# EAGLE design etch-a-sketch (EAGLE 9.6.2)
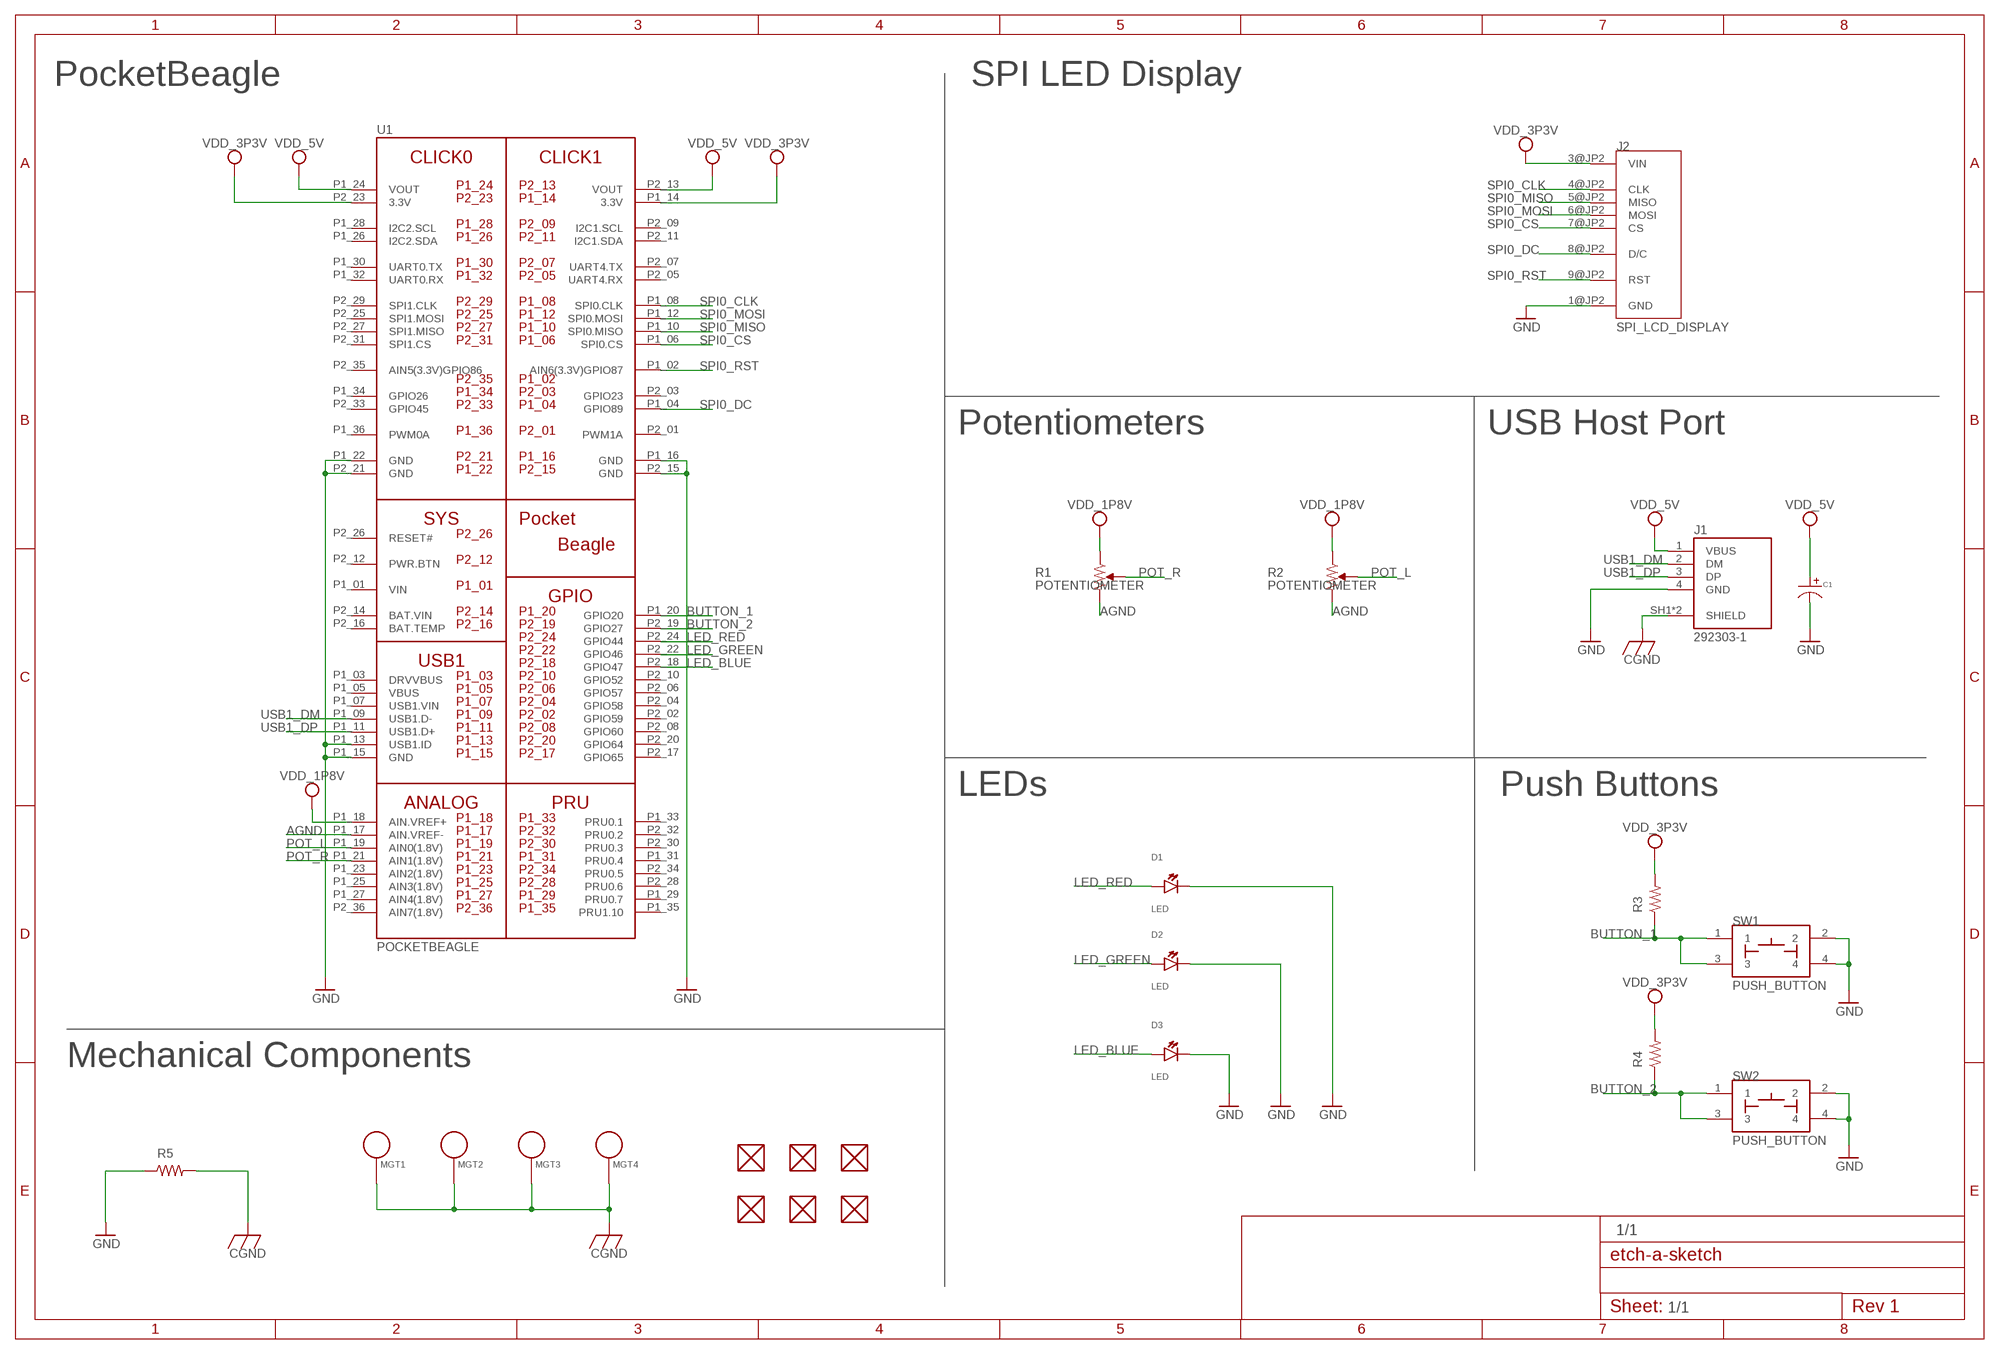
[diagram p0: schematic, sheet 1]

## Parts
C1  CAPACITOR_P_10MM  [CP10MM]
D1  LED  [EIA-STD]
D2  LED  [EIA-STD]
D3  LED  [EIA-STD]
FUD1  FIDUCIAL  [FIDUCIAL_40MIL]
FUD2  FIDUCIAL  [FIDUCIAL_40MIL]
FUD3  FIDUCIAL  [FIDUCIAL_40MIL]
FUD4  FIDUCIAL  [FIDUCIAL_40MIL]
FUD5  FIDUCIAL  [FIDUCIAL_40MIL]
FUD6  FIDUCIAL  [FIDUCIAL_40MIL]
J1  292303-1  [TE_292303-1]
J2  SPI_LCD_DISPLAY  [TFT_LCD_PCB]
MGT1  MOUNTING_HOLE  [MOUNTING_HOLE]
MGT2  MOUNTING_HOLE  [MOUNTING_HOLE]
MGT3  MOUNTING_HOLE  [MOUNTING_HOLE]
MGT4  MOUNTING_HOLE  [MOUNTING_HOLE]
R1  POTENTIOMETER  [POT-PO90S]
R2  POTENTIOMETER  [POT-PO90S]
R3  R_R0603  [R0603]
R4  R_R0603  [R0603]
R5  R_R0603  [R0603]
SW1  PUSH_BUTTON  [BUTTON_12.5MM]
SW2  PUSH_BUTTON  [BUTTON_12.5MM]
U1  POCKETBEAGLE  [POCKETBEAGLE]

## Nets
AGND: R1.CW R2.CW U1.P1_17(AIN.VREF-)
BUTTON_1: R3.1 SW1.1 SW1.3 U1.P1_20(GPIO20)
BUTTON_2: R4.1 SW2.1 SW2.3 U1.P2_19(GPIO27)
CGND: J1.SH1(SHIELD) J1.SH2(SHIELD) MGT1.P$1 MGT2.P$1 MGT3.P$1 MGT4.P$1 R5.2
GND: C1.P$2 D1.CATHODE D2.CATHODE D3.CATHODE J1.4(GND) J2.1@JP2(GND) R5.1 SW1.2 SW1.4 SW2.2 SW2.4 U1.P1_13(USB1.ID) U1.P1_15(GND) U1.P1_16(GND) U1.P1_22(GND) U1.P2_15(GND) U1.P2_21(GND)
LED_BLUE: D3.ANODE U1.P2_18(GPIO47)
LED_GREEN: D2.ANODE U1.P2_22(GPIO46)
LED_RED: D1.ANODE U1.P2_24(GPIO44)
POT_L: R2.S U1.P1_19(AIN0(1.8V))
POT_R: R1.S U1.P1_21(AIN1(1.8V))
SPI0_CLK: J2.4@JP2(CLK) U1.P1_08(SPI0.CLK)
SPI0_CS: J2.7@JP2(CS) U1.P1_06(SPI0.CS)
SPI0_DC: J2.8@JP2(D/C) U1.P1_04(GPIO89)
SPI0_MISO: J2.5@JP2(MISO) U1.P1_10(SPI0.MISO)
SPI0_MOSI: J2.6@JP2(MOSI) U1.P1_12(SPI0.MOSI)
SPI0_RST: J2.9@JP2(RST) U1.P1_02(AIN6(3.3V)GPIO87)
USB1_DM: J1.2(DM) U1.P1_09(USB1.D-)
USB1_DP: J1.3(DP) U1.P1_11(USB1.D+)
VDD_1P8V: R1.CCW R2.CCW U1.P1_18(AIN.VREF+)
VDD_3P3V: J2.3@JP2(VIN) R3.2 R4.2 U1.P1_14(3.3V) U1.P2_23(3.3V)
VDD_5V: C1.P$1 J1.1(VBUS) U1.P1_24(VOUT) U1.P2_13(VOUT)
Unconnected: FUD1.P$1 FUD2.P$1 FUD3.P$1 FUD4.P$1 FUD5.P$1 FUD6.P$1 U1.P1_03(DRVVBUS) U1.P1_05(VBUS) U1.P1_07(USB1.VIN) U1.P1_23(AIN2(1.8V)) U1.P1_25(AIN3(1.8V)) U1.P1_26(I2C2.SDA) U1.P1_27(AIN4(1.8V)) U1.P1_28(I2C2.SCL) U1.P1_29(PRU0.7) U1.P1_30(UART0.TX) U1.P1_31(PRU0.4) U1.P1_32(UART0.RX) U1.P1_33(PRU0.1) U1.P1_34(GPIO26) U1.P1_35(PRU1.10) U1.P1_36(PWM0A) U1.P2_01(PWM1A) U1.P2_02(GPIO59) U1.P2_03(GPIO23) U1.P2_04(GPIO58) U1.P2_05(UART4.RX) U1.P2_06(GPIO57) U1.P2_07(UART4.TX) U1.P2_08(GPIO60) U1.P2_09(I2C1.SCL) U1.P2_10(GPIO52) U1.P2_11(I2C1.SDA) U1.P2_12(PWR.BTN) U1.P2_16(BAT.TEMP) U1.P2_17(GPIO65) U1.P2_20(GPIO64) U1.P2_25(SPI1.MOSI) U1.P2_26(RESET#) U1.P2_27(SPI1.MISO) U1.P2_28(PRU0.6) U1.P2_29(SPI1.CLK) U1.P2_30(PRU0.3) U1.P2_31(SPI1.CS) U1.P2_32(PRU0.2) U1.P2_33(GPIO45) U1.P2_34(PRU0.5) U1.P2_35(AIN5(3.3V)GPIO86) U1.P2_36(AIN7(1.8V))

## Notes on the sheet
- PocketBeagle | SPI LED Display
- Potentiometers | USB Host Port
- LEDs | Push Buttons
- Mechanical Components
- 1/1
- 1/1

## Power pins joined to a net without a drawn wire
BAT.VIN: U1.P2_14(BAT.VIN)
VIN: U1.P1_01(VIN)

## Library data of the parts
C1 = etchpre:CAPACITOR_P: Library: MF_Passives Description: Device for Polarized Capacitors. Manufacture part number (MPN), Voltage Rating, and Tolerance can be added via Attributes. Check https://factory.macrofab.com/parts for the house parts list.; POPULATE: 1
D1-D3 = etchpre:LED: EIA-STD LED, LTST-C191TBKT
FUD1-FUD6 = etchpre:FIDUCIAL
J1 = etchpre:292303-1: CONN USB RECEPT R/A TYPE A 4POS Check availability <https://pricing.snapeda.com/parts/292303-1/TE%20Connectivity/view-part?ref=eda>; AVAILABILITY: In Stock; CENTERLINE_PITCH: 2 mm[.078 in]; COMMENT: 292303-1; DESCRIPTION: Conn; Data; USB; Recept; 2.0; 4 Pos; 1 Port; Rt Angle; A Ser; Tin over Copper; EU_ROHS_COMPLIANCE: Compliant; MF: TE Connectivity; MP: 292303-1; NUMBER_OF_POSITIONS: 4; PACKAGE: None; PRICE: None; PRODUCT_TYPE: Connector; PURCHASE-URL: https://pricing.snapeda.com/search/part/292303-1/?ref=eda
J2 = etchpre:SPI_LCD_DISPLAY
MGT1-MGT4 = etchpre:MOUNTING_HOLE: Chassis Mounting Hole w/GND connection ability
R1 R2 = etchpre:POTENTIOMETER: Potentiometer - Examples: P090S-14T20BR10K (987-1277-ND)
R3-R5 = etchpre:R_: RESISTOR, American symbol
SW1 SW2 = etchpre:PUSH_BUTTON
U1 = etchpre:POCKETBEAGLE

## Board
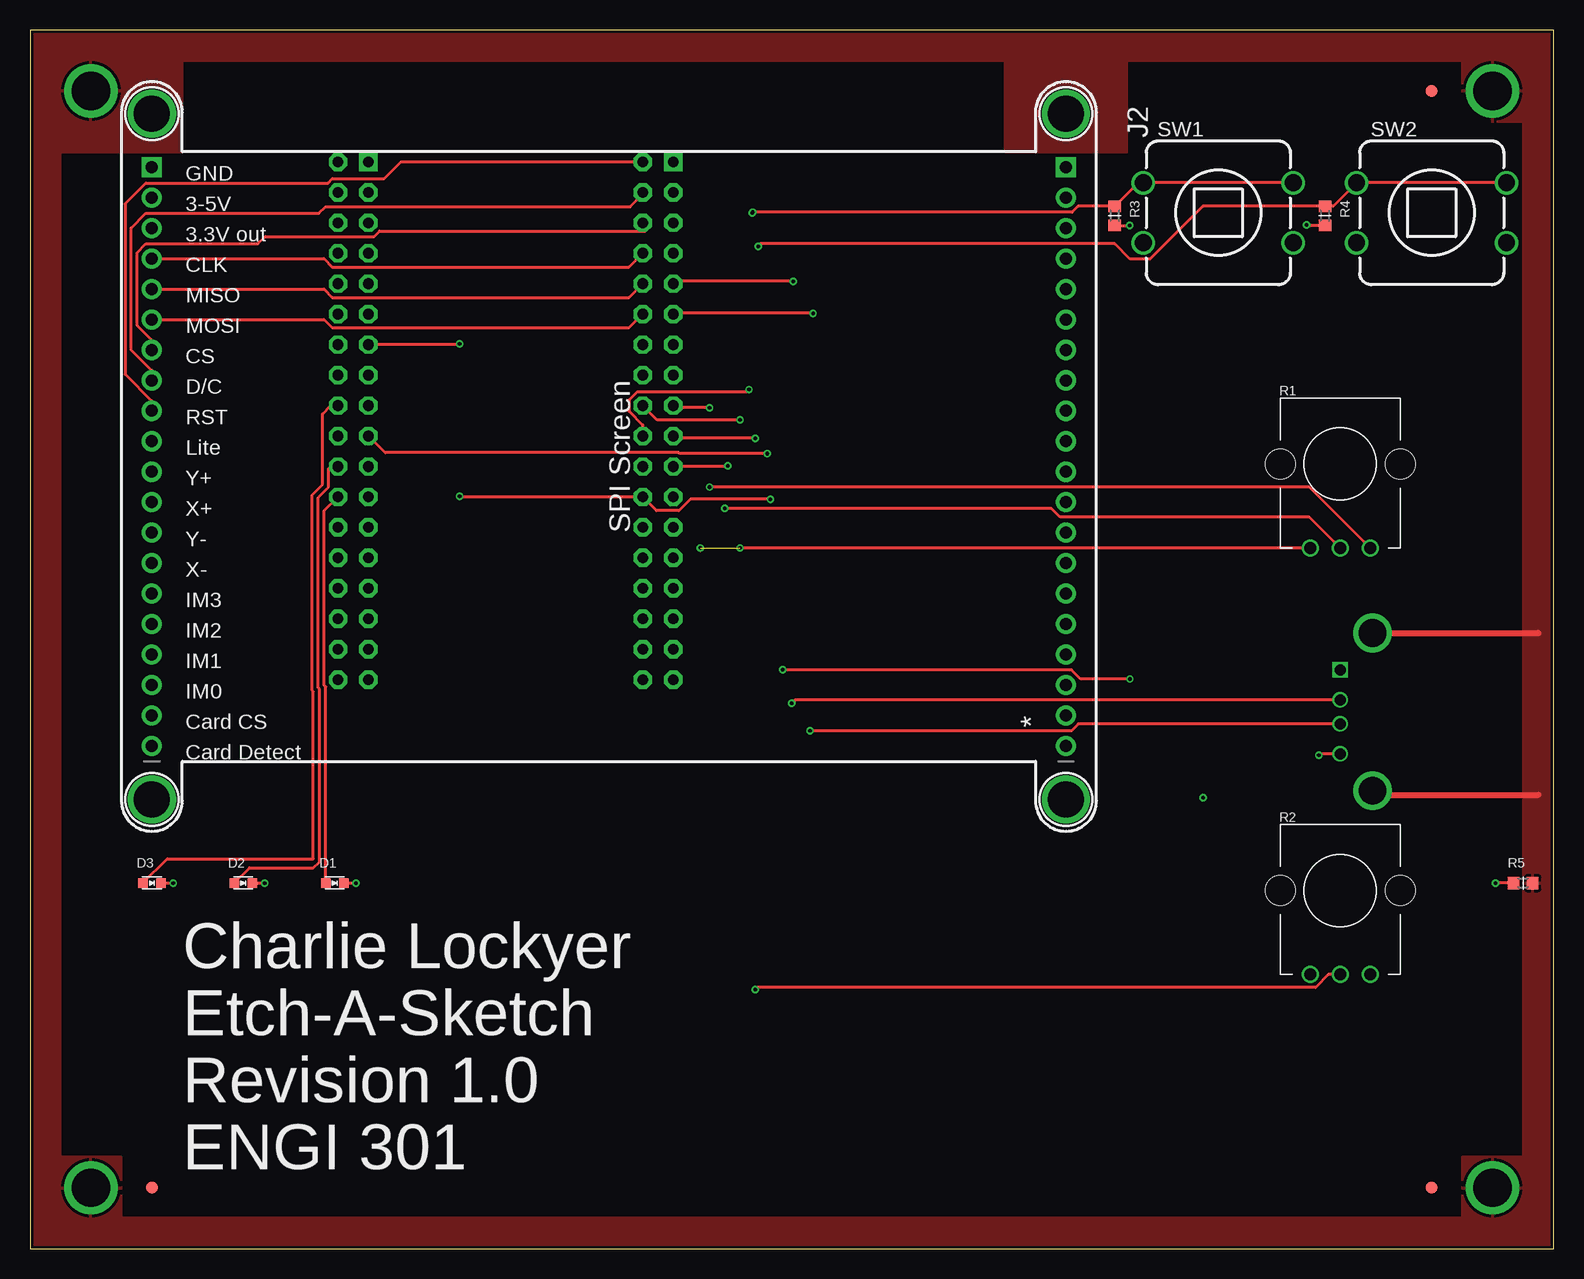
[diagram p1: board, top side]
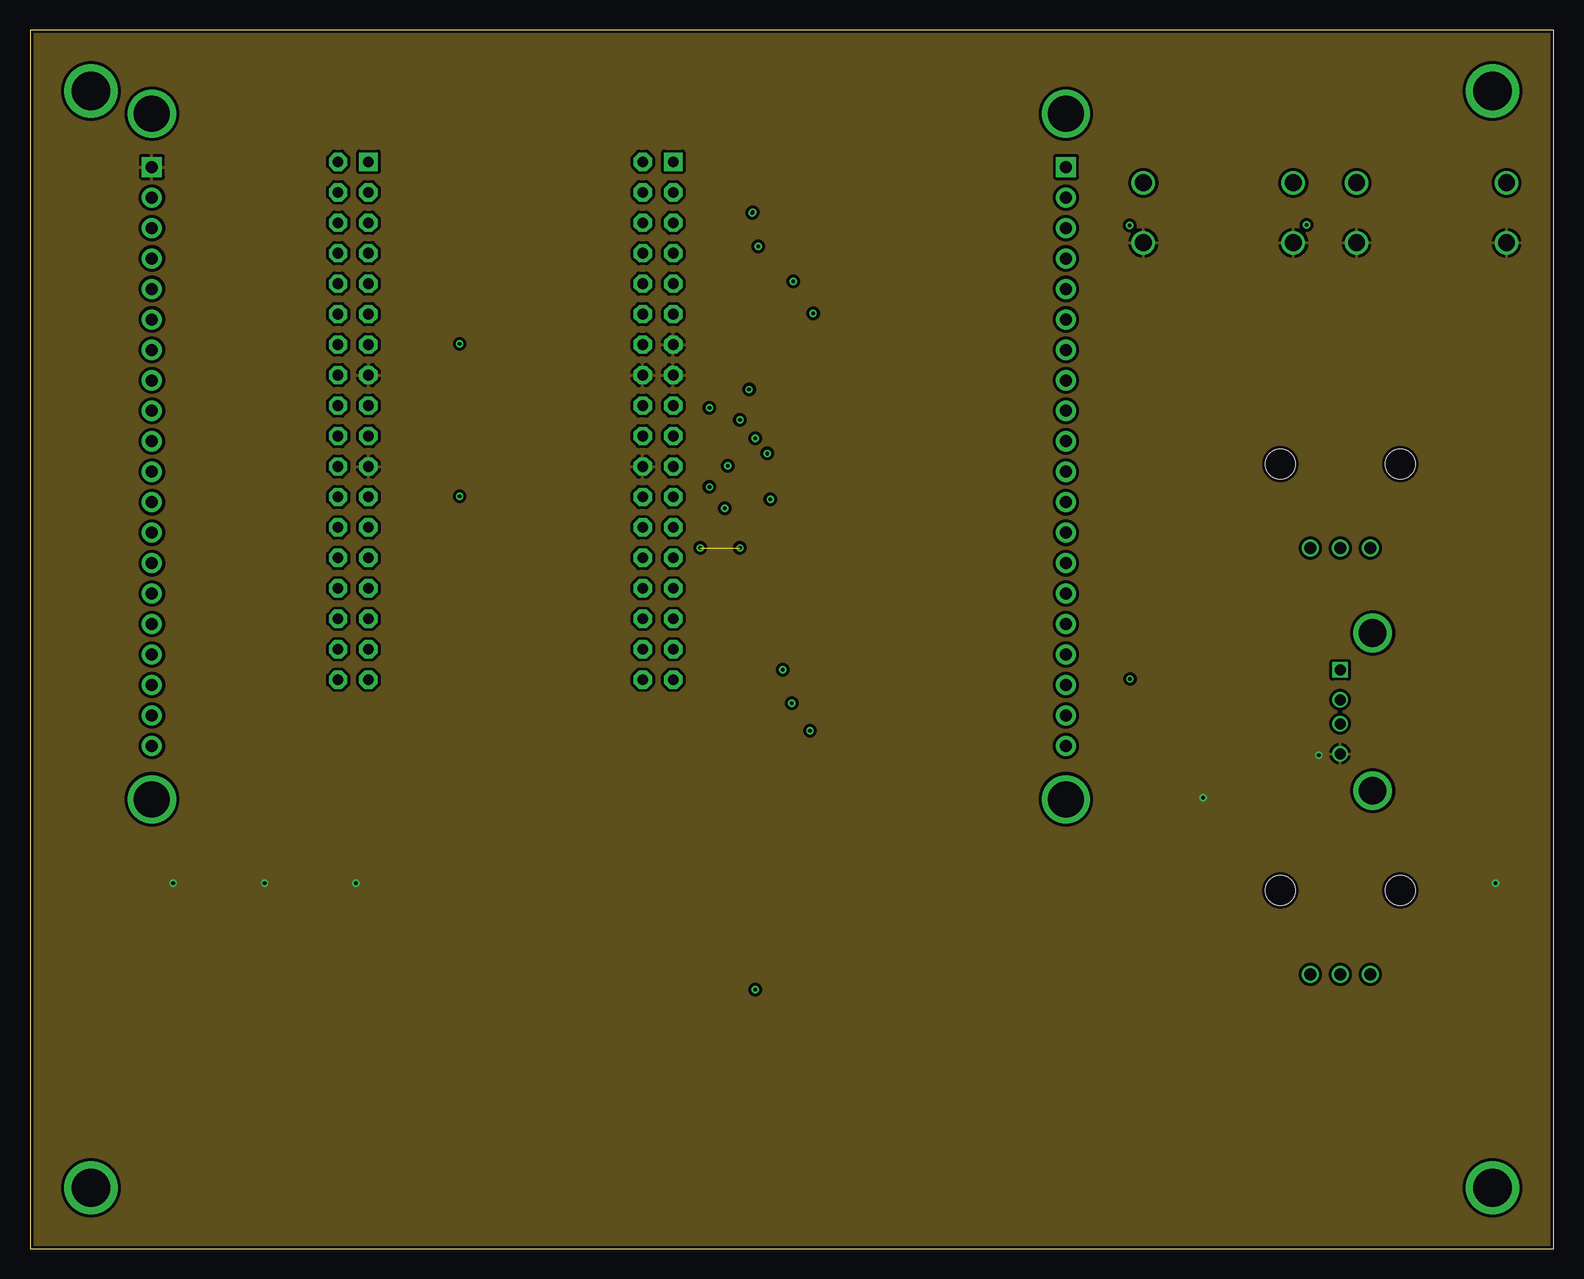
[diagram p2: board, inner layer Route2]
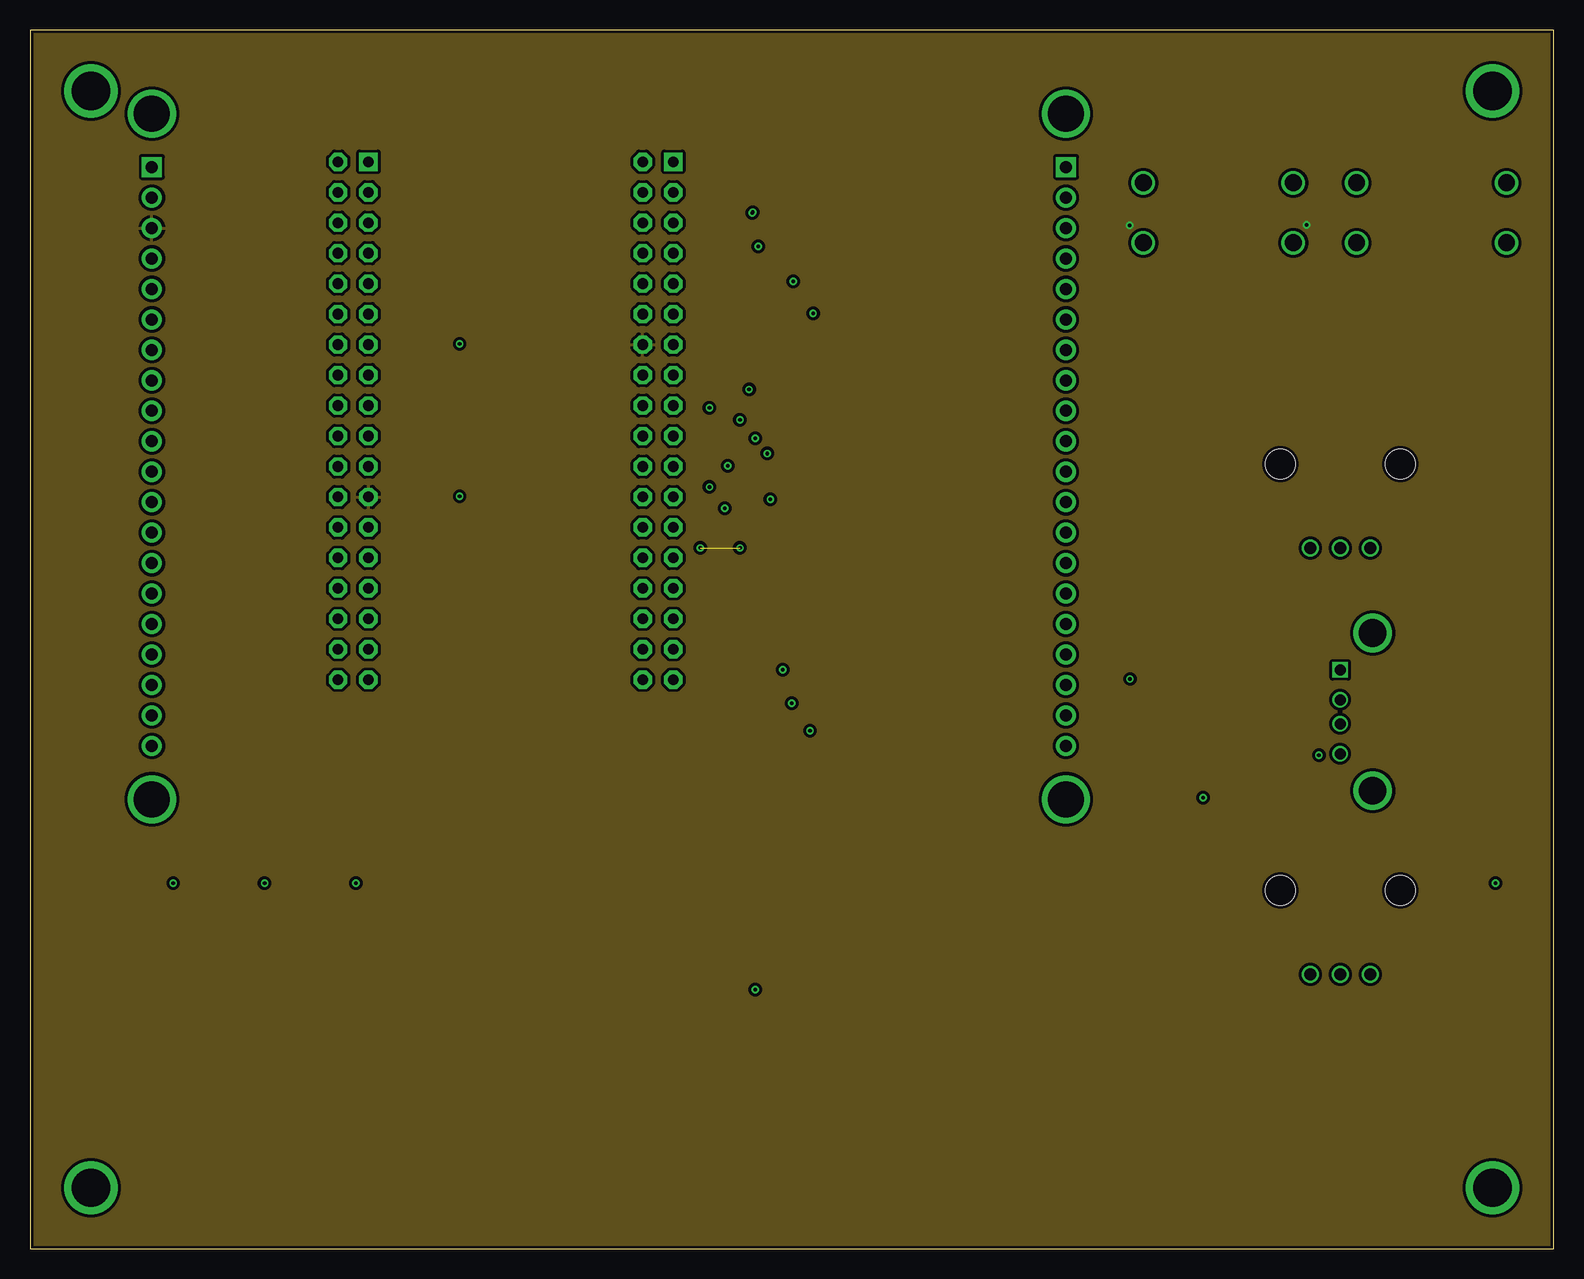
[diagram p3: board, inner layer Route15]
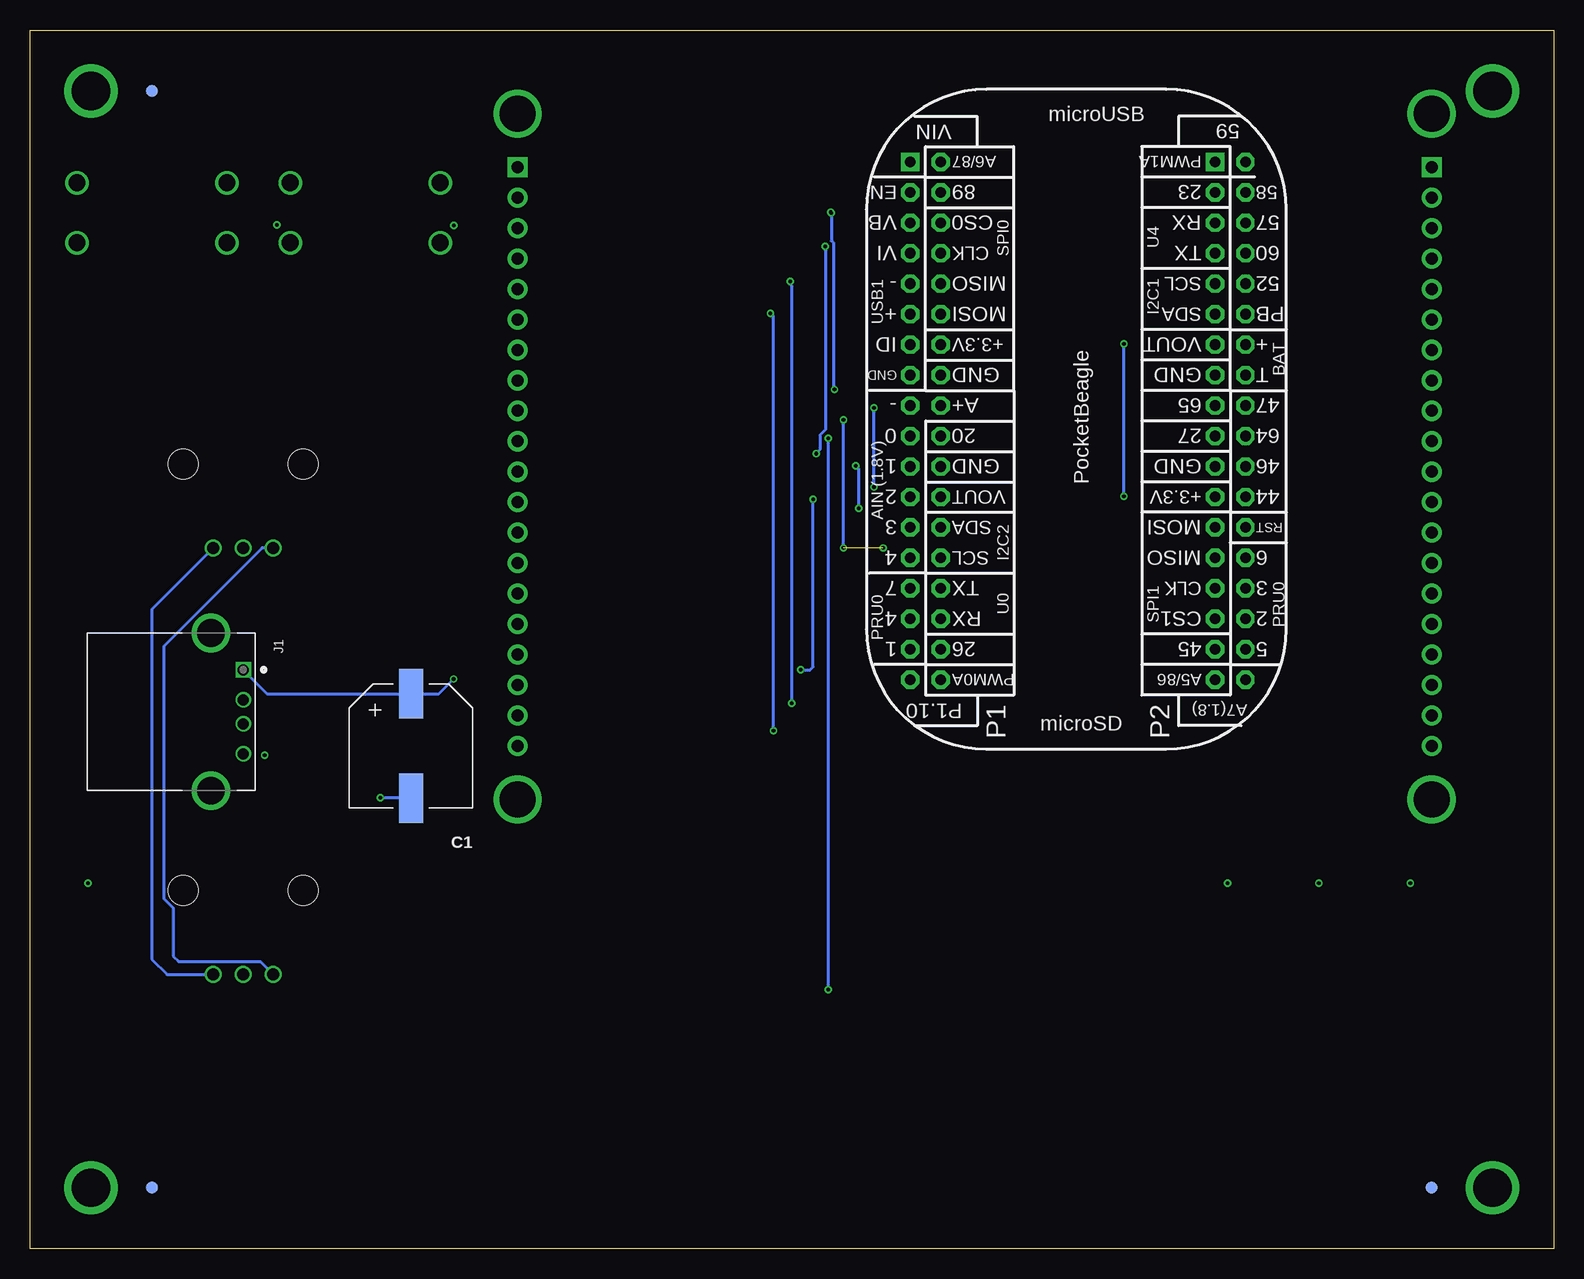
[diagram p4: board, bottom side, seen from below]

Size 127 x 101.6 mm. Coordinates in mm from the lower left corner, seen from the top.
Outline: 0,0 127,0 127,101.6 0,101.6 0,0
Copper layers (1*2*15*16): Top 0.035mm / dielectric 0.23mm / Route2 0.035mm / dielectric 0.93mm / Route15 0.035mm / dielectric 0.23mm / Bottom 0.035mm
Design rules "ENGI301_4lyr": minimum track width 10mil, minimum drill 12mil, track to track 10mil, track to pad 10mil, pad to pad 10mil, via to via 10mil, smd to smd 10mil, copper to edge 10mil, drill to drill 12mil, minimum pad ring 6mil, minimum via ring 6mil, stop-mask expansion 3mil, vias tented up to drill 25mil, thermal gap 10mil

### Footprints (pad centres in the part's own frame; a part is rotated, then mirrored left to right if it is on the bottom)
CP10MM = smd 2 x 4.1: P$1 0,-4.35; P$2 0,4.35
EIA-STD = smd 0.8 x 0.8: ANODE -0.75,0; CATHODE 0.75,0
FIDUCIAL_40MIL = smd 1.016 x 1.016: P$1 0,0
TE_292303-1 = drill 0.92 square: 1 0,0 | drill 0.92: 2 2.5,0; 3 4.5,0; 4 7,0 | drill 2.3: SH1 -3.07,-2.71; SH2 10.07,-2.71
TFT_LCD_PCB = drill 1 pad 1.676 square: 1@JP1 -24.13,38.1; 1@JP2 -24.13,-38.1 | drill 1 pad 1.676: 2@JP1 -21.59,38.1; 2@JP2 -21.59,-38.1; 3@JP1 -19.05,38.1; 3@JP2 -19.05,-38.1; 4@JP1 -16.51,38.1; 4@JP2 -16.51,-38.1; 5@JP1 -13.97,38.1; 5@JP2 -13.97,-38.1; 6@JP1 -11.43,38.1; 6@JP2 -11.43,-38.1; 7@JP1 -8.89,38.1; 7@JP2 -8.89,-38.1; 8@JP1 -6.35,38.1; 8@JP2 -6.35,-38.1; 9@JP1 -3.81,38.1; 9@JP2 -3.81,-38.1; 10@JP1 -1.27,38.1; 10@JP2 -1.27,-38.1; 11@JP1 1.27,38.1; 11@JP2 1.27,-38.1; 12@JP1 3.81,38.1; 12@JP2 3.81,-38.1; 13@JP1 6.35,38.1; 13@JP2 6.35,-38.1; 14@JP1 8.89,38.1; 14@JP2 8.89,-38.1; 15@JP1 11.43,38.1; 15@JP2 11.43,-38.1; 16@JP1 13.97,38.1; 16@JP2 13.97,-38.1; 17@JP1 16.51,38.1; 17@JP2 16.51,-38.1; 18@JP1 19.05,38.1; 18@JP2 19.05,-38.1; 19@JP1 21.59,38.1; 19@JP2 21.59,-38.1; 20@JP1 24.13,38.1; 20@JP2 24.13,-38.1 | drill 3 pad 3.6: P$1@U$7 -28.575,-38.1; P$1@U$15 28.575,-38.1; P$1@U$16 -28.575,38.1; P$1@U$17 28.575,38.1
MOUNTING_HOLE = drill 3.175 pad 4.445: P$1 0,0
POT-PO90S = drill 1: CCW -2.5,0; CW 2.5,0; S 0,0 | hole 2.5: -5,7; 5,7
R0603 = smd 0.95 x 1.031: 1 -0.8,0; 2 0.8,0
BUTTON_12.5MM = drill 1.4: 1 -6.25,2.5; 2 -6.25,-2.5; 3 6.25,2.5; 4 6.25,-2.5
POCKETBEAGLE = drill 0.889 pad 1.524 square: P1_01 5.91,3.53; P2_01 5.91,28.93 | drill 0.889 pad 1.524 octagon: P1_02 5.91,6.07; P1_03 8.45,3.53; P1_04 8.45,6.07; P1_05 10.99,3.53; P1_06 10.99,6.07; P1_07 13.53,3.53; P1_08 13.53,6.07; P1_09 16.07,3.53; P1_10 16.07,6.07; P1_11 18.61,3.53; P1_12 18.61,6.07; P1_13 21.15,3.53; P1_14 21.15,6.07; P1_15 23.69,3.53; P1_16 23.69,6.07; P1_17 26.23,3.53; P1_18 26.23,6.07; P1_19 28.77,3.53; P1_20 28.77,6.07; P1_21 31.31,3.53; P1_22 31.31,6.07; P1_23 33.85,3.53; P1_24 33.85,6.07; P1_25 36.39,3.53; P1_26 36.39,6.07; P1_27 38.93,3.53; P1_28 38.93,6.07; P1_29 41.47,3.53; P1_30 41.47,6.07; P1_31 44.01,3.53; P1_32 44.01,6.07; P1_33 46.55,3.53; P1_34 46.55,6.07; P1_35 49.09,3.53; P1_36 49.09,6.07; P2_02 5.91,31.47; P2_03 8.45,28.93; P2_04 8.45,31.47; P2_05 10.99,28.93; P2_06 10.99,31.47; P2_07 13.53,28.93; P2_08 13.53,31.47; P2_09 16.07,28.93; P2_10 16.07,31.47; P2_11 18.61,28.93; P2_12 18.61,31.47; P2_13 21.15,28.93; P2_14 21.15,31.47; P2_15 23.69,28.93; P2_16 23.69,31.47; P2_17 26.23,28.93; P2_18 26.23,31.47; P2_19 28.77,28.93; P2_20 28.77,31.47; P2_21 31.31,28.93; P2_22 31.31,31.47; P2_23 33.85,28.93; P2_24 33.85,31.47; P2_25 36.39,28.93; P2_26 36.39,31.47; P2_27 38.93,28.93; P2_28 38.93,31.47; P2_29 41.47,28.93; P2_30 41.47,31.47; P2_31 44.01,28.93; P2_32 44.01,31.47; P2_33 46.55,28.93; P2_34 46.55,31.47; P2_35 49.09,28.93; P2_36 49.09,31.47

### Placement (x,y rotation side)
C1  95.25,41.91 180 bottom
D1  25.4,30.48 0 top
D2  17.78,30.48 0 top
D3  10.16,30.48 0 top
FUD1  116.84,5.08 0 bottom
FUD2  10.16,5.08 0 bottom
FUD3  116.84,96.52 0 bottom
FUD4  116.84,96.52 0 top
FUD5  116.84,5.08 0 top
FUD6  10.16,5.08 0 top
J1  109.22,48.26 270 bottom
J2  48.26,66.04 270 top
MGT1  121.92,96.52 0 top
MGT2  121.92,5.08 0 top
MGT3  5.08,5.08 0 top
MGT4  5.08,96.52 0 top
R1  109.22,58.42 0 top
R2  109.22,22.86 0 top
R3  90.42,86.11 270 top
R4  107.95,86.11 270 top
R5  124.46,30.48 0 top
SW1  99.06,86.36 0 top
SW2  116.84,86.36 0 top
U1  57.15,96.52 270 bottom

### Tracks (layer width: path | path; a pad name or v marks a point on that pad's centre or on a via)
AGND  (via drill 0.3 pad 0.61)
  Top 0.254: R1.CW 106.64,63.5 v56.64,63.5 | v56.64,70.1 53.81,70.1 U1.P1_17
  Bottom 0.254: v56.64,63.5 v56.64,70.1 | R1.CW 116.84,53.3 116.84,24.13 115.57,22.86 R2.CW
BUTTON_1  (via drill 0.3 pad 0.61)
  Top 0.254: SW1.3 SW1.1 92.38,88.86 R3.1 87.36,86.91 86.86,86.41 v60.25,86.41 | v59.94,71.63 59.75,71.43 50.61,71.43 49.94,70.76 49.94,69.82 51.08,68.67 U1.P1_20
  Route2 0.254: v60.25,86.41 v60.2,86.36
  Bottom 0.254: v60.2,86.36 60.2,84.03 60.02,83.85 60.02,71.7 v59.94,71.63
BUTTON_2  (via drill 0.3 pad 0.61)
  Top 0.254: SW2.3 SW2.1 108.64,86.91 R4.1 97.78,86.91 93.37,82.5 91.7,82.5 90.43,83.77 60.91,83.77 v60.71,83.57 | v61.47,66.29 54.15,66.29 54.09,66.35 29.62,66.35 U1.P2_19
  Bottom 0.254: v60.71,83.57 60.71,68.28 61.14,67.85 61.14,66.62 v61.47,66.29
CGND
  Top 0.508: J1.SH2 112.27,37.85 125.73,37.85 | J1.SH1 125.71,51.33 125.73,51.31
  pour Top: 2.54,50.8 -2.54,50.8 -2.54,-2.54 129.54,-2.54 129.54,50.8 124.46,50.8 124.46,7.62 119.38,7.62 119.38,2.54 7.62,2.54 7.62,7.62 2.54,7.62
  pour Top: -2.54,50.8 2.54,50.8 2.54,91.44 12.7,91.44 12.7,99.06 81.28,99.06 81.28,91.44 91.44,91.44 91.44,99.06 119.38,99.06 119.38,93.98 124.46,93.98 124.46,50.8 129.54,50.8 129.54,104.14 -2.54,104.14
GND  (via drill 0.3 pad 0.61)
  Top 0.254: D3.CATHODE v11.94,30.48 | D2.CATHODE v19.56,30.48 | D1.CATHODE v27.18,30.48 | J1.4 107.55,41.26 v107.44,41.15 | R5.1 v122.17,30.48
  Bottom 0.254: C1.P$2 97.76,37.56 v97.79,37.59
  pour Route2: -5.08,-5.08 -5.08,106.68 132.08,106.68 132.08,-5.08
LED_BLUE
  Top 0.254: D3.ANODE 11.44,32.51 23.62,32.51 23.62,46.44 23.52,46.54 23.52,62.85 24.38,63.71 24.38,69.6 25.08,70.29 U1.P2_18
LED_GREEN
  Top 0.254: D2.ANODE 18.3,31.75 23.62,31.75 24.13,32.26 24.13,46.65 24.09,46.69 24.03,46.75 24.03,62.63 24.89,63.5 24.89,65.02 25.08,65.21 U1.P2_22
LED_RED
  Top 0.254: D1.ANODE 24.65,46.84 24.54,46.96 24.54,61.53 U1.P2_24
POT_L  (via drill 0.3 pad 0.61)
  Top 0.254: R2.S 108.25,22.86 107.17,21.78 60.64,21.78 v60.45,21.59 | v60.45,67.56 53.81,67.56 U1.P1_19
  Bottom 0.254: v60.45,21.59 v60.45,67.56
POT_R  (via drill 0.3 pad 0.61)
  Top 0.254: v57.91,61.72 85.14,61.72 85.86,61.01 106.63,61.01 R1.S | v58.17,65.28 58.1,65.21 U1.P1_21
  Bottom 0.254: v57.91,61.72 57.91,65.02 v58.17,65.28
SPI0_CLK
  Top 0.254: J2.4@JP2 24.5,82.55 25.21,81.85 49.94,81.85 U1.P1_08
SPI0_CS
  Top 0.254: J2.7@JP2 10.16,75.75 8.94,76.97 8.94,83.06 9.65,83.77 19,83.77 19.62,84.39 28.69,84.39 29.14,84.84 51.31,84.84 51.31,85.3 U1.P1_06
SPI0_DC
  Top 0.254: J2.8@JP2 10.16,73.21 8.43,74.93 8.43,85.09 9.65,86.31 24.08,86.31 24.64,86.87 50.04,86.87 51.08,87.91 U1.P1_04
SPI0_MISO
  Top 0.254: J2.5@JP2 24.5,80.01 25.21,79.31 49.94,79.31 U1.P1_10
SPI0_MOSI
  Top 0.254: J2.6@JP2 24.5,77.47 25.21,76.77 49.94,76.77 U1.P1_12
SPI0_RST
  Top 0.254: U1.P1_02 30.92,90.61 29.52,89.21 25.21,89.21 24.84,88.85 9.65,88.85 7.92,87.12 7.92,72.9 10.16,70.67 J2.9@JP2
USB1_DM  (via drill 0.3 pad 0.61)
  Top 0.254: J1.2 63.79,45.76 v63.5,45.47 | v63.63,80.64 53.81,80.64 U1.P1_09
  Bottom 0.254: v63.5,45.47 63.5,80.26 63.75,80.52 v63.63,80.64
USB1_DP  (via drill 0.3 pad 0.61)
  Top 0.254: J1.3 87.39,43.76 86.81,43.18 v65.02,43.18 | v65.28,77.98 53.69,77.98 U1.P1_11
  Bottom 0.254: v65.02,43.18 65.02,77.72 v65.28,77.98
VDD_1P8V  (via drill 0.3 pad 0.61)  (1 unrouted)
  Top 0.254: 55.88,58.17 v55.88,58.42 | R1.CCW v59.18,58.42 | v59.18,69.09 52.28,69.09 U1.P1_18
  Bottom 0.254: v59.18,58.42 v59.18,69.09 | R1.CCW 107.66,58.42 115.85,50.23 115.85,29.18 115.06,28.39 115.06,24.38 114.62,23.94 107.8,23.94 R2.CCW
VDD_3P3V  (via drill 0.3 pad 0.61)
  Top 0.254: R4.2 106.72,85.31 106.68,85.34 v106.43,85.34 | R3.2 v91.66,85.31 91.69,85.34
  pour Route15: -7.62,-7.62 -7.62,109.22 134.62,109.22 134.62,-7.62
VDD_5V  (via drill 0.3 pad 0.61)
  Top 0.254: v91.69,47.5 87.58,47.5 86.81,48.26 v62.74,48.26 | v61.72,62.48 55.05,62.48 54.09,61.53 52.22,61.53 U1.P1_24 35.88,62.67 v35.81,62.74 | v35.81,75.44 35.75,75.37 U1.P2_13
  Bottom 0.254: J1.1 107.22,46.26 C1.P$1 92.93,46.26 v91.69,47.5 | v61.72,62.48 61.72,48.51 61.98,48.26 v62.74,48.26 | v35.81,62.74 v35.81,75.44

### Text on the board
tPlace: Charlie Lockyer | Etch-A-Sketch | Revision 1.0 | ENGI 301